# Altium schematic sheet Power Stages.SchDoc
size A2; SheetNumber: 1; SheetTotal: 3
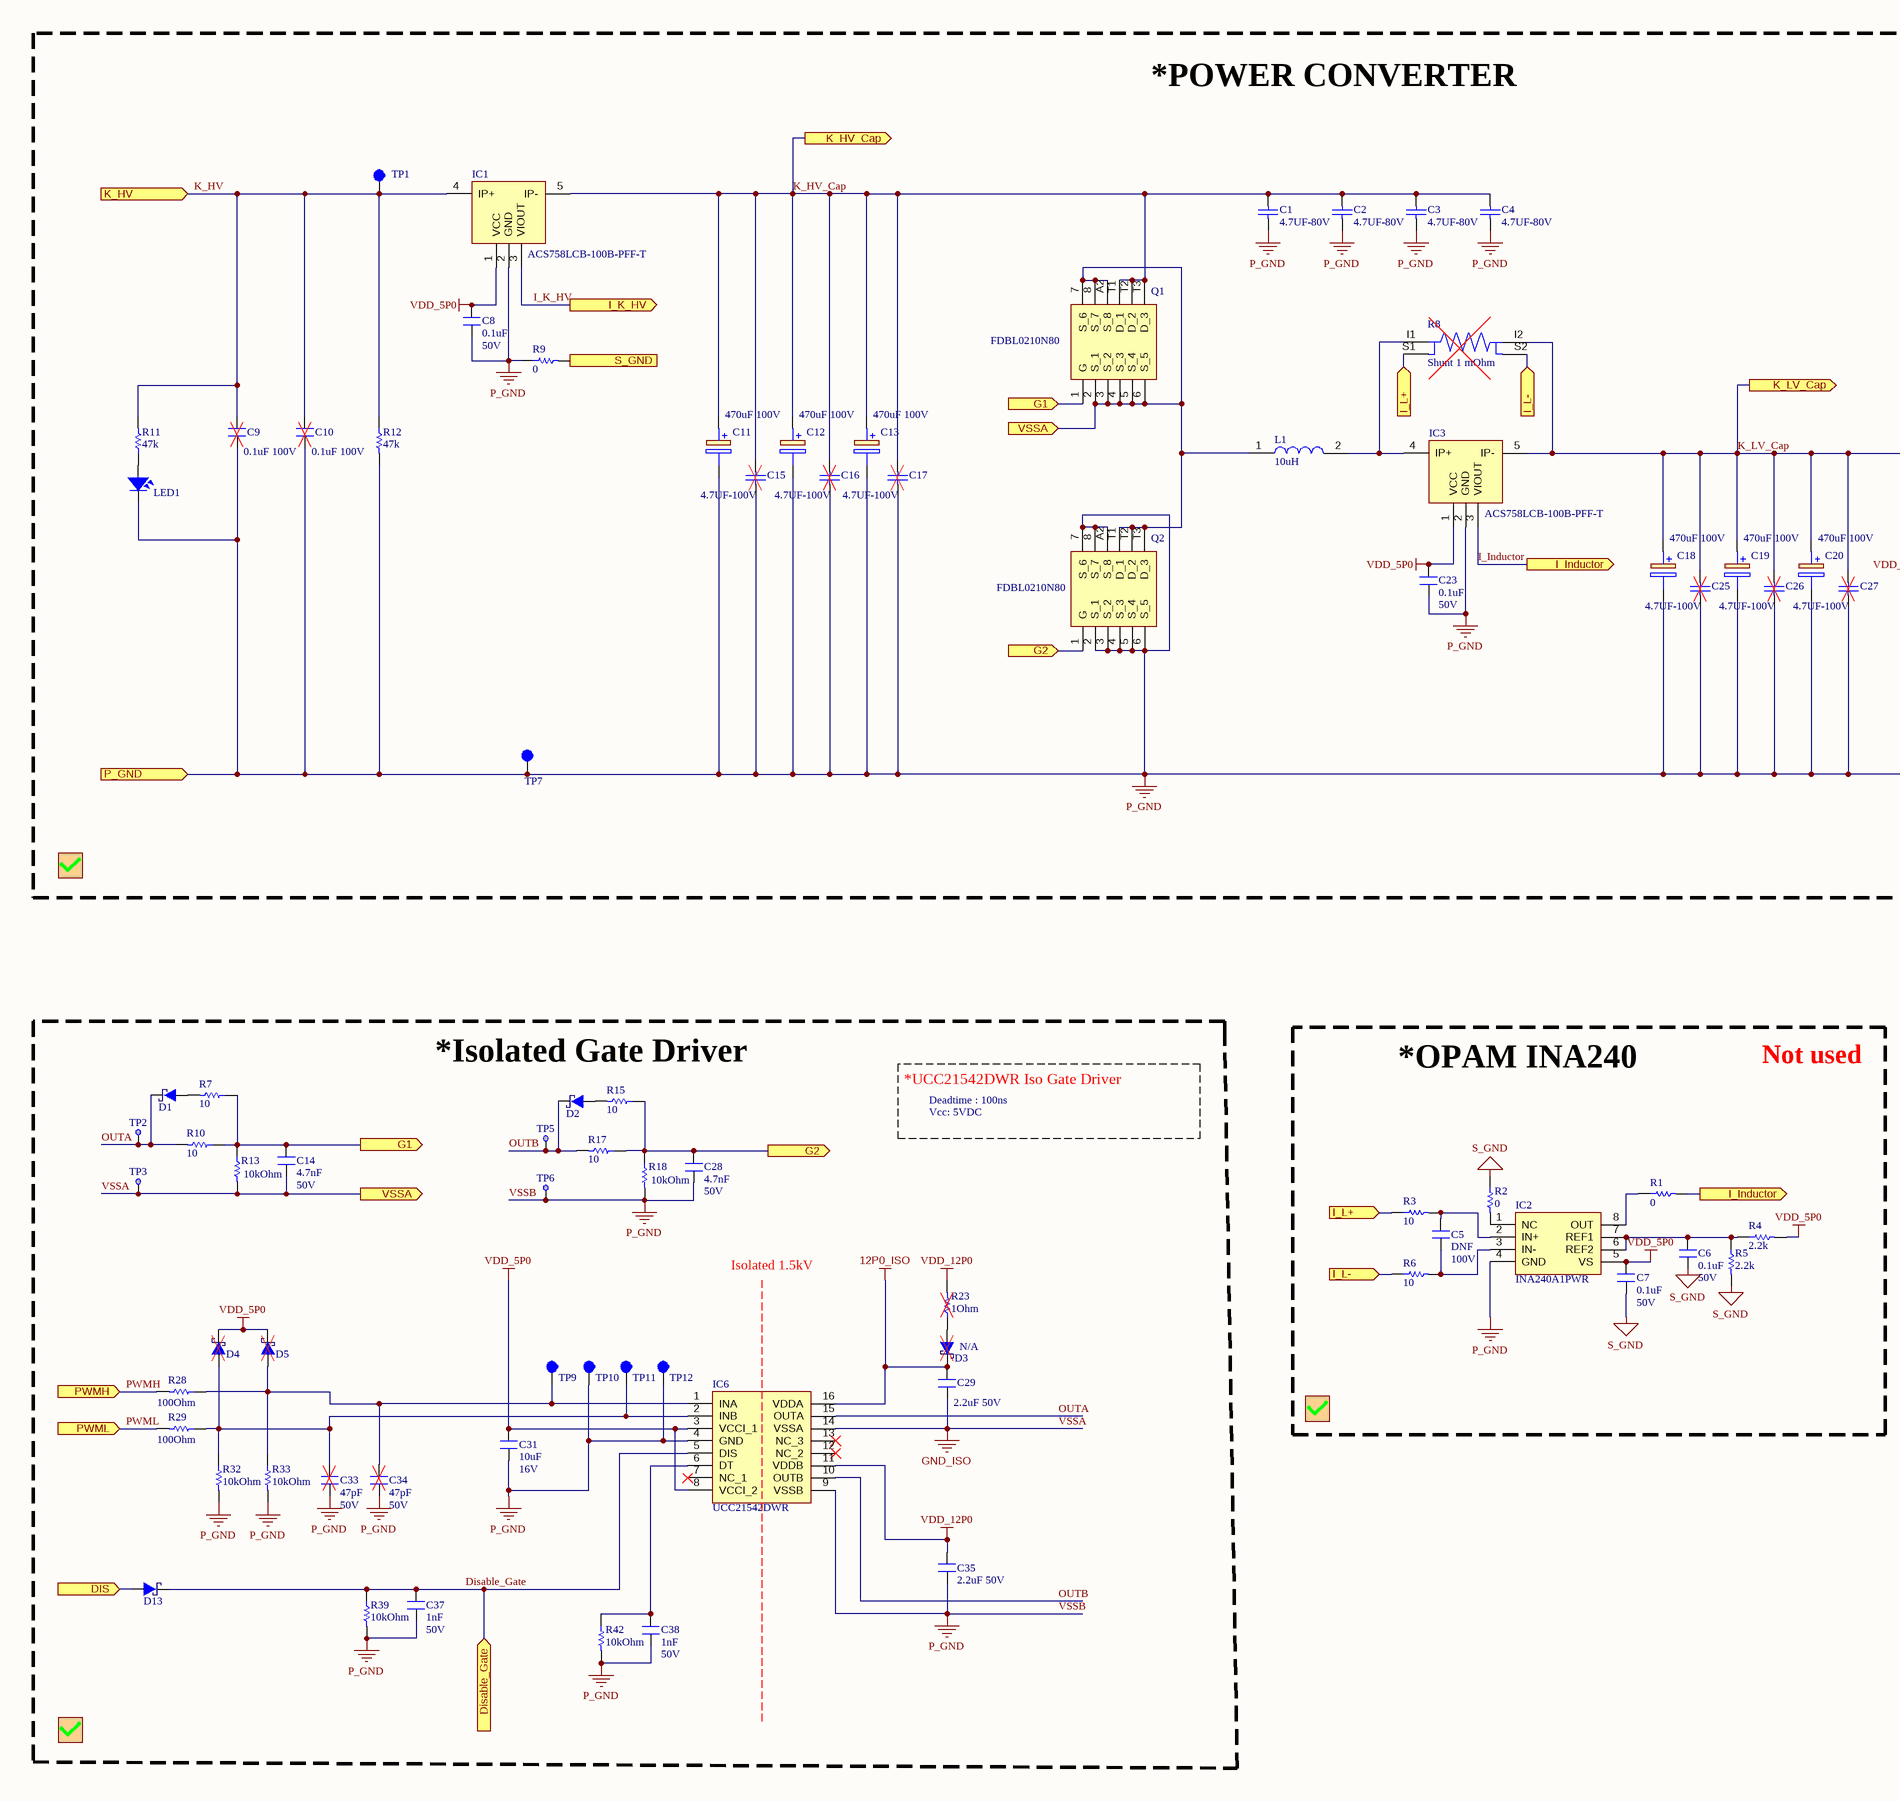
[diagram p0: Power Stages.SchDoc, left]
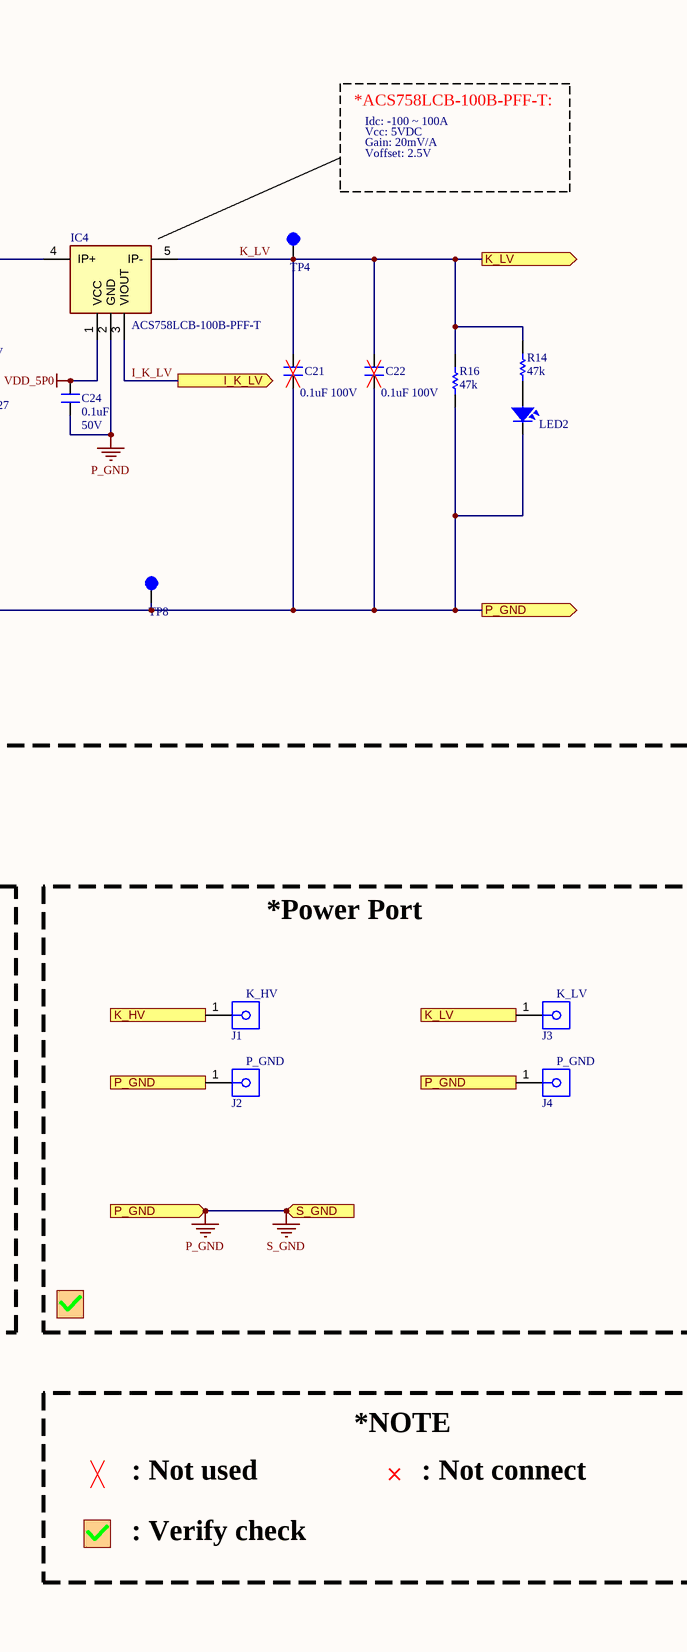
[diagram p1: Power Stages.SchDoc, right]

## Parts
C1  value 4.7UF-80V  [C_1210]  (hidden comment: GRM32ER71K475KE14L)
C2  value 4.7UF-80V  [C_1210]  (hidden comment: GRM32ER71K475KE14L)
C3  value 4.7UF-80V  [C_1210]  (hidden comment: GRM32ER71K475KE14L)
C4  value 4.7UF-80V  [C_1210]  (hidden comment: GRM32ER71K475KE14L)
C5  DNF  value 100V  [C_0603]
C6  0.1uF  value 50V  [C_0603]
C7  0.1uF  value 50V  [C_0603]
C8  0.1uF  value 50V  [C_0603]
C9  0.1uF 100V  [C_1206]
C10  0.1uF 100V  [C_1206]
C11  470uF 100V  [CAP-ALU-13MM*30MM]
C12  470uF 100V  [CAP-ALU-13MM*30MM]
C13  470uF 100V  [CAP-ALU-13MM*30MM]
C14  4.7nF  value 50V  [C_0603]
C15  value 4.7UF-100V  [C_1210]  (hidden comment: GRM32ER71K475KE14L)
C16  value 4.7UF-100V  [C_1210]  (hidden comment: GRM32ER71K475KE14L)
C17  value 4.7UF-100V  [C_1210]  (hidden comment: GRM32ER71K475KE14L)
C18  470uF 100V  [CAP-ALU-13MM*30MM]
C19  470uF 100V  [CAP-ALU-13MM*30MM]
C20  470uF 100V  [CAP-ALU-13MM*30MM]
C21  0.1uF 100V  [C_1206]
C22  0.1uF 100V  [C_1206]
C23  0.1uF  value 50V  [C_0603]
C24  0.1uF  value 50V  [C_0603]
C25  value 4.7UF-100V  [C_1210]  (hidden comment: GRM32ER71K475KE14L)
C26  value 4.7UF-100V  [C_1210]  (hidden comment: GRM32ER71K475KE14L)
C27  value 4.7UF-100V  [C_1210]  (hidden comment: GRM32ER71K475KE14L)
C28  4.7nF  value 50V  [C_0603]
C29  2.2uF 50V  [C_1206]
C31  10uF  value 16V  [C_0805]
C33  47pF  value 50V  [C_0603]
C34  47pF  value 50V  [C_0603]
C35  2.2uF 50V  [C_1206]
C37  1nF  value 50V  [C_0603]
C38  1nF  value 50V  [C_0603]
D1  B0520WS-7-F  [SOD323F]  (value not drawn)
D2  B0520WS-7-F  [SOD323F]  (value not drawn)
D3  PMEG2010AEJ,115  [SOD123]  (value not drawn)
D4  PMEG2010AEJ,115  [SOD323F]  (value not drawn)
D5  PMEG2010AEJ,115  [SOD323F]  (value not drawn)
D13  PMEG2010AEJ,115  [SOD323F]  (value not drawn)
IC1  ACS758LCB-100B-PFF-T  [ACS772ECB200BPFFT]
IC2  INA240A1PWR  [SOP65P640X120-8N]
IC3  ACS758LCB-100B-PFF-T  [ACS772ECB200BPFFT]
IC4  ACS758LCB-100B-PFF-T  [ACS772ECB200BPFFT]
IC6  UCC21542DWR  [SOIC127P1030X265-16N]
J1  K_HV  [HOLE_5mm_RED]
J2  P_GND  [HOLE_5mm_BLACK]
J3  K_LV  [HOLE_5mm_RED]
J4  P_GND  [HOLE_5mm_BLACK]
L1  10uH  [CSCF3218-6R8MC]
LED1  LED SMD  [SM-LED-0805-Blue]  (value not drawn)
LED2  LED SMD  [SM-LED-0805-Blue]  (value not drawn)
Q1  FDBL0210N80  [NTBLS1D5N10MC - duplicate]
Q2  FDBL0210N80  [NTBLS1D5N10MC - duplicate]
R1  0  [R_0603]
R2  0  [R_0603]
R3  10  [R_0603]
R4  2.2k  [R_0603]
R5  2.2k  [R_0603]
R6  10  [R_0603]
R7  10  [R_0805]
R8  Shunt 1 mOhm  [PSG4/PSF4]
R9  value 0  [R_0603]  (hidden comment: 0603)
R10  10  [R_0805]
R11  47k  [R_0603]
R12  47k  [R_1206]
R13  value 10kOhm  [R_0603]  (hidden comment: 0603)
R14  47k  [R_0603]
R15  10  [R_0805]
R16  47k  [R_1206]
R17  10  [R_0805]
R18  value 10kOhm  [R_0603]  (hidden comment: 0603)
R23  value 1Ohm  [R_0603]  (hidden comment: 0603)
R28  value 100Ohm  [R_0603]  (hidden comment: 0603)
R29  value 100Ohm  [R_0603]  (hidden comment: 0603)
R32  value 10kOhm  [R_0603]  (hidden comment: 0603)
R33  value 10kOhm  [R_0603]  (hidden comment: 0603)
R39  value 10kOhm  [R_0603]  (hidden comment: 0603)
R42  value 10kOhm  [R_0603]  (hidden comment: 0603)
TP1  Test Point  [TP_1mm_through_hole]  (value not drawn)
TP2  TP  [TP_1mm]  (value not drawn)  (no BOM)
TP3  TP  [TP_1mm]  (value not drawn)  (no BOM)
TP4  Test Point  [TP_1mm_through_hole]  (value not drawn)
TP5  TP  [TP_1mm]  (value not drawn)  (no BOM)
TP6  TP  [TP_1mm]  (value not drawn)  (no BOM)
TP7  Test Point  [TP_1mm_through_hole]  (value not drawn)
TP8  Test Point  [TP_1mm_through_hole]  (value not drawn)
TP9  Test Point  [TP_1mm_through_hole]  (value not drawn)
TP10  Test Point  [TP_1mm_through_hole]  (value not drawn)
TP11  Test Point  [TP_1mm_through_hole]  (value not drawn)
TP12  Test Point  [TP_1mm_through_hole]  (value not drawn)

## Blocks framed on the sheet
*POWER CONVERTER: C1-C4 C8-C13 C15-C27 IC1 IC3 IC4 L1 LED1 LED2 Q1 Q2 R8 R9 R11 R12 R14 R16 TP1 TP4 TP7 TP8
*Isolated Gate Driver: C14 C28 C29 C31 C33-C35 C37 C38 D1-D5 D13 IC6 R7 R10 R13 R15 R17 R18 R23 R28 R29 R32 R33 R39 R42 TP2 TP3 TP5 TP6 TP9-TP12
*OPAM INA240: C5-C7 IC2 R1-R6
*Power Port: J1-J4

## Ports
DIS (in), Disable_Gate (in), G1 (in), G1 (out), G2 (in), G2 (out), I_Inductor (out), I_K_HV (out), I_K_LV (out), I_L+ (in), I_L- (in), K_HV (in), K_HV_Cap (out), K_LV (in), K_LV (out), K_LV_Cap (out), P_GND (in), P_GND (out), PWMH (in), PWML (in), S_GND (in), S_GND (out), VSSA (in), VSSA (out)

## Nets
12P0_ISO: C29.2 D3.2 IC6.16(VDDA)
VDD_5P0: C7.1 C8.2 C23.2 C24.2 C31.2 D4.2 D5.2 IC1.1(VCC) IC2.5(VS) IC3.1(VCC) IC4.1(VCC) IC6.3(VCCI_1) IC6.8(VCCI_2) R4.1
VDD_12P0: C35.1 IC6.11(VDDB) R23.1
VSSA: C14.1 C29.1 IC6.14(VSSA) L1.1 Q1.2(S_1) Q1.3(S_2) Q1.4(S_3) Q1.5(S_4) Q1.6(S_5) Q1.7(S_6) Q1.8(S_7) Q1.A2(S_8) Q2.T1(D_1) Q2.T2(D_2) Q2.T3(D_3) R13.1 TP3.1(TP) ; port VSSA  [also labelled GND_ISO]
VSSB: C1.1 C2.1 C3.1 C4.1 C6.1 C7.2 C8.1 C9.1 C10.1 C11.2(-) C12.2(-) C13.2(-) C15.1 C16.1 C17.1 C18.2(-) C19.2(-) C20.2(-) C21.1 C22.1 C23.1 C24.1 C25.1 C26.1 C27.1 C28.1 C31.1 C33.2 C34.2 C35.2 C37.1 C38.1 IC1.2(GND) IC2.4(GND) IC3.2(GND) IC4.2(GND) IC6.4(GND) IC6.9(VSSB) J2.1 J4.1 LED1.2 LED2.2 Q2.2(S_1) Q2.3(S_2) Q2.4(S_3) Q2.5(S_4) Q2.6(S_5) Q2.7(S_6) Q2.8(S_7) Q2.A2(S_8) R2.2 R5.1 R9.1 R9.2 R12.1 R16.1 R18.1 R32.1 R33.1 R39.1 R42.1 TP6.1(TP) TP7.1(B) TP8.1(B) TP10.1(B) TP12.1(B) ; port P_GND, port S_GND  [also labelled P_GND, S_GND]
DIS: D13.1 ; port DIS
Disable_Gate: C37.2 D13.2 IC6.5(DIS) R39.2 ; port Disable_Gate
G1: C14.2 Q1.1(G) R7.2 R10.2 R13.2 ; port G1
G2: C28.2 Q2.1(G) R15.2 R17.2 R18.2 ; port G2
I_Inductor: IC3.3(VIOUT) R1.1 ; port I_Inductor
I_K_HV: IC1.3(VIOUT) ; port I_K_HV
I_K_LV: IC4.3(VIOUT) ; port I_K_LV
I_L+: R3.2 R8.S1 ; port I_L+
I_L-: R6.2 R8.S2 ; port I_L-
K_HV: C9.2 C10.2 IC1.4(IP+) J1.1 R11.1 R12.2 TP1.1(B) ; port K_HV
K_HV_Cap: C1.2 C2.2 C3.2 C4.2 C11.1(+) C12.1(+) C13.1(+) C15.2 C16.2 C17.2 IC1.5(IP-) Q1.T1(D_1) Q1.T2(D_2) Q1.T3(D_3) ; port K_HV_Cap
K_LV: C21.2 C22.2 IC4.5(IP-) J3.1 R14.1 R16.2 TP4.1(B) ; port K_LV
K_LV_Cap: C18.1(+) C19.1(+) C20.1(+) C25.2 C26.2 C27.2 IC3.5(IP-) IC4.4(IP+) R8.I2 ; port K_LV_Cap
OUTA: D1.2 IC6.15(OUTA) R10.1 TP2.1(TP)
OUTB: D2.2 IC6.10(OUTB) R17.1 TP5.1(TP)
PWMH: R28.1 ; port PWMH
PWML: R29.1 ; port PWML
NetC5_1: C5.1 IC2.2(IN+) R3.1
NetC5_2: C5.2 IC2.3(IN-) R6.1
NetC6_2: C6.2 IC2.6(REF2) IC2.7(REF1) R4.2 R5.2
NetC33_1: C33.1 D4.1 IC6.2(INB) R29.2 R32.2 TP11.1(B)
NetC34_1: C34.1 D5.1 IC6.1(INA) R28.2 R33.2 TP9.1(B)
NetC38_2: C38.2 IC6.6(DT) R42.2
NetD1_1: D1.1 R7.1
NetD2_1: D2.1 R15.1
NetD3_1: D3.1 R23.2
NetIC2_1: IC2.1(NC) R2.1
NetIC2_8: IC2.8(OUT) R1.2
NetIC3_4: IC3.4(IP+) L1.2 R8.I1
NetLED1_1: LED1.1 R11.2
NetLED2_1: LED2.1 R14.2

Not connected (* = marked no-connect by the designer): IC6 7(NC_1)* 12(NC_2)* 13(NC_3)*

## Notes on the sheet
- *ACS758LCB-100B-PFF-T:
- Idc: -100 ~ 100A
- Voffset: 2.5V
- Gain: 20mV/A
- Vcc: 5VDC
- *UCC21542DWR Iso Gate Driver
- Deadtime : 100ns
- Not used
- Isolated 1.5kV
- (near D3) N/A
- *NOTE
- : Not used
- : Not connect
- : Verify check
- Title:
- Project:
- Power Converter Module
- DC/DC Bidirectional Converter
- Revision:
- CLA Power Electronics
- 36 Xuan Thuy, Dich Vong Hau
- Draw:
- File Name:
- AnhDT
- Check:
- Approve:
- Sheet:
- 1
- Size:
- of
- A2
- Modified Date:
- Cau Giay - Ha Noi
- Time:
- Date:
- ©2023

## Library data of the parts
C1-C4 C15-C17 C25-C27 = Cap 1210: CAP CER 4.7uF 80V X7R 1210; Manufacturer: TDK Corporation; Description std: CAP CER 4.7UF 100V X7S 1210; Category: Capacitors; Part Number: GRM32ER71K475KE14L; Link: https://www.digikey.com/product-detail/en/tdk-corporation/C3225X7S2A475M200AB/445-6043-2-ND/2443521; Digikey Price/1KU: 0.56250; Package: 1210; Digikey Price/1unit: 1.64
C5 = Cap_Cer_0603_1nF: Manufacturer: Murata Electronics; Part Number: GCM188R71E102KA37D; Part Code: S1200-000081; Description SEL: CAP CER 1000PF 25V X7R 0603; Point: 2; Footprint Type: SMD
C6 C7 = Cap_Cer_0603_1nF: CAP CER 0.1UF 50V X7R 0603; Manufacturer: Murata Electronics; Part Number: GCM188R71E102KA37D; Part Code: S1200-000081; Description SEL: CAP CER 1000PF 25V X7R 0603; Point: 2; Footprint Type: SMD
C8 C23 C24 = Cap_Cer_0603_1nF_25V: CAP CER 0.1UF 16V X5R 0603; Manufacturer: Murata Electronics; Part Number: CL21A106KOCLRNC; Part Code: S1200-000082; Description SEL: CAP CER 10UF 16V X5R 0805; Point: 2; Footprint Type: SMD
C9 C10 C21 C22 C29 C35 = Cap_Cer_1206_1uF: Ceramic Capacitor 1206 (+-10% TH)/(+10%SMD); Manufacturer: TDK Corporation; Part Number: C3216X7R2A105K160AA; Part Code: S1200-000129; Description SEL: CAP CER 1UF 100V X7R 1206; Point: 2; Footprint Type: SMD
C11-C13 C18-C20 = 100ZLH470MEFC16X31.5: CAP ALUM 470UF 20% 80V RADIAL; Manufacturer_Name: Panasonic Electronic Components; Part Number: EEU-FS1K471L; Value: 470uF 80V; Height: 33.5mm; Mouser Part Number: EEU-FS1K471L; Mouser Price/Stock: https://www.digikey.com/en/products/detail/panasonic-electronic-components/EEU-FS1K471L/9597020; Arrow Part Number: EEU-FS1K471L; Arrow Price/Stock: https://www.arrow.com/en/products/100zlh470mefc16x31.5/rubycon?region=nac
C14 C28 = Cap_Cer_0603_1nF_25V: CAP CER 0805 4.7NF 50V C0G 5%; Manufacturer: KEMET; Part Number: C0805C472J5GECAUTO; Part Code: S1200-000082; Point: 2; Description SEL: CAP CER 0805 4.7NF 50V C0G 5%; Footprint Type: SMD
C31 = Cap_Cer_0805_10pF: CAP CER 10uF 16V X7R 0805; Manufacturer: Kemet; Part Number: CL21A106KOCLRNC; Part Code: S1200-000116; Point: 2; Description SEL: CAP CER 10uF 16V X7R 0805; Footprint Type: SMD
C33 C34 C37 C38 = Cap_Cer_0603_1nF_25V: CAP CER 1nF 50V X7R 0603; Manufacturer: Murata Electronics; Part Number: GCM188R71E102KA37D; Part Code: S1200-000082; Description SEL: CAP CER 1000PF 25V X7R 0603; Point: 2; Footprint Type: SMD
D1-D3 D13 = PMEG2010AEJ,115: DIODE SCHOTTKY 20V 1A SOD323F; Manufacturer: Nexperia USA Inc.; Current: 1A (DC); Category: DIODE; Part Number: PMEG2010AEJ,115; Footprint/Package: SOD-323F; Footprint type: SMD; Voltage: 20 V
D4 D5 = PMEG2010AEJ,115: DIODE SCHOTTKY 30V 0.2A SOD323F; Manufacturer: Nexperia USA Inc.; Part Number: BAT54HT1G; Current: 0.2A (DC); Voltage: 20 V; Category: DIODE; Footprint/Package: SOD-323F; Footprint type: SMD
IC1 IC3 IC4 = ACS758LCB-100B-PFF-T: Integrated Circuit; Manufacturer_Name: Allegro Microsystems; Datasheet Link: https://www.allegromicro.com/-/media/files/datasheets/acs758-datasheet.ashx; Height: 7.1mm; Manufacturer_Part_Number: ACS758LCB-100B-PFF-T; Mouser Part Number: 250-758LCB100BPFFT; Mouser Price/Stock: https://www.mouser.co.uk/ProductDetail/Allegro-MicroSystems/ACS758LCB-100B-PFF-T?qs=pUKx8fyJudA0WtlqV%2Fcrcw%3D%3D; Arrow Part Number: ACS758LCB-100B-PFF-T; Arrow Price/Stock: https://www.arrow.com/en/products/acs758lcb-100b-pff-t/allegro-microsystems?region=nac
IC2 = INA240A1PWR: Integrated Circuit; Manufacturer_Name: Texas Instruments; Datasheet Link: http://www.ti.com/lit/gpn/INA240; Height: 1.2mm; Manufacturer_Part_Number: INA240A1PWR; Mouser Part Number: 595-INA240A1PWR; Mouser Price/Stock: https://www.mouser.co.uk/ProductDetail/Texas-Instruments/INA240A1PWR?qs=aVyJF2WnouTDXnRi6tpqfA%3D%3D; Arrow Part Number: INA240A1PWR; Arrow Price/Stock: https://www.arrow.com/en/products/ina240a1pwr/texas-instruments?region=nac
IC6 = UCC21542DWR: REINFORCED ISOLATION DUAL-CHANNE; Manufacturer_Name: Texas Instruments; Datasheet Link: https://www.ti.com/lit/ds/symlink/ucc21542.pdf?ts=1623395410745&ref_url=https%253A%252F%252Fwww.ti.com%252Fstore%252Fti%252Fen%252Fp%252Fproduct%252F%253Fp%253DUCC21542DWKR; Height: 2.65mm; Part Number: UCC21542DWR; Mouser Part Number: 595-UCC21542DWR; Mouser Price/Stock: https://www.mouser.co.uk/ProductDetail/Texas-Instruments/UCC21542DWR?qs=DRkmTr78QARxjB5fL7Hhaw%3D%3D
J1-J4 = CONN_1P: Electric Pole 1; Footprint type: TH; Footprint/Package: Nonstandard
L1 = IHDF1300AEEH4R7K10: 10-µH with a specified saturation current of 70-A DC; Height: 15.4mm
LED1 LED2 = LED-SMD-0805: LED BLUE 1/4W 0805
Q1 Q2 = IPLU300N04S4R8XTMA1: MOSFET N-CH 80V 240A 8HPSOF; Manufacturer_Name: Infineon; Height: 2.3mm; Part Number: FDBL0210N80; Mouser Part Number: FDBL0210N80; Arrow Part Number: IPLU300N04S4R8XTMA1
R1 R2 = Resistor_0603_10Ohm 1%: RES 0 OHM 1% 1/8W 0603; Manufacturer: KOA Speer Electronics, Inc.; Part Number: RK73H1JRTTD10R0F; Part Code: S1100-000044; Description SEL: RES 10 OHM 1% 1/8W 0603; Point: 2; Value: 8.2-10kOhm; Footprint Type: SMD; Power: 1/8W; Tolerance: 1%
R3 R6 = Resistor_0603_10Ohm 1%: RES 10 OHM 1% 1/8W 0603; Manufacturer: KOA Speer Electronics, Inc.; Part Number: RK73H1JRTTD10R0F; Part Code: S1100-000044; Point: 2; Description SEL: RES 10 OHM 1% 1/8W 0603; Footprint Type: SMD; Power: 1/8W; Tolerance: 1%
R4 R5 = Resistor_0603_10Ohm 1%: RES 2.2k OHM 1% 1/8W 0603; Manufacturer: KOA Speer Electronics, Inc.; Part Number: RK73H1JRTTD10R0F; Part Code: S1100-000044; Description SEL: RES 10 OHM 1% 1/8W 0603; Point: 2; Footprint Type: SMD; Power: 1/8W; Tolerance: 1%
R7 R10 R15 R17 = Resistor_0805_10Ohm: RES 10 OHM 1% 1/8W 0805; Part Number: RE0805FRE0710RL; Manufacturer: YAGEO; Part Code: S1100-000072; Description SEL: RES SMD 10 OHM 1% 1/8W 0805; Point: 2; Footprint Type: SMD; Power: 1/8W; Tolerance: 1%
R8 = PSG4NTEBL500F: RES 1m OHM 1% 10W NONSTANDARD; Manufacturer: KOA Speer Electronics, Inc.; Value: 1 mOhm; Part Number: PSG4NTEBL500F; Footprint/Package: Nonstandard; Footprint type: SMD; Tolerance: ±1%; Category: Resistor
R9 = Resistor_0603_10kOhm 1%: RES 0 OHM 1% 1/10W 0603; Manufacturer: YAGEO; Part Number: RC0603FR-7W10KL; Part Code: S1100-000043; Description SEL: RES 10K OHM 1% 1/10W 0603; Point: 2; Footprint Type: SMD; Power: 1/10W; Tolerance: 1%
R11 R14 = Resistor_0603_10Ohm 1%: RES 47K OHM 1% 1/10W 0603; Manufacturer: YAGEO; Part Number: RC0603FR-07100KL; Part Code: S1100-000044; Description SEL: RES 10 OHM 1% 1/8W 0603; Point: 2; Power: 1/8W; Footprint Type: SMD; Tolerance: 1%
R12 R16 = Resistor_1206_0Ohm: RES 47K OHM 1/4W 1206; Manufacturer: YAGEO; Part Number: RC1206JR-070RL; Part Code: S1100-000177; Description SEL: RES 0 OHM JUMPER 1/4W 1206; Point: 2; Tolerance: Jumper; Footprint Type: SMD; Power: 1/4W
R13 R18 = Resistor_0603_10kOhm 1%: RES 10K OHM 1% 1/10W 0603; Manufacturer: YAGEO; Part Number: RC0603FR-7W10KL; Part Code: S1100-000043; Point: 2; Description SEL: RES 10K OHM 1% 1/10W 0603; Footprint Type: SMD; Power: 1/10W; Tolerance: 1%
R23 = Resistor_0603_1Ohm: RES 1OHM 1% 1/8W 0603; Manufacturer: Vishay Dale; Part Number: MCT06030C1008FP500; Part Code: S1100-000140; Point: 2; Description SEL: RES 1 OHM 1% 1/8W 0603; Footprint Type: SMD; Power: 1/8W; Tolerance: 1%
R28 R29 = Resistor_0603_100Ohm: RES 100 OHM 1% 1/8W 0603; Manufacturer: KOA Speer Electronics, Inc.; Part Number: RK73H1JRTTD1000F; Part Code: S1100-000052; Point: 2; Description SEL: RES 100 OHM 1% 1/8W 0603; Footprint Type: SMD; Power: 1/8W; Tolerance: 1%
R32 R33 R39 R42 = Resistor_0603_100Ohm: RES 10 kOHM 1% 1/8W 0603; Manufacturer: KOA Speer Electronics, Inc.; Part Number: RK73H1JRTTD1000F; Part Code: S1100-000052; Description SEL: RES 100 OHM 1% 1/8W 0603; Point: 2; Footprint Type: SMD; Power: 1/8W; Tolerance: 1%
TP1 TP4 TP7-TP12 = Test Point: PC TEST POINT COMPACT RED; Part Number: 5005; Manufacturer: Keystone Electronics
TP2 TP3 TP5 TP6 = Test_Point_1mm: Test Point; ComponentLink1Description: New link; ComponentLink1URL: *; ComponentLink2Description: New link; ComponentLink2URL: *; Creator: SELEX MOTORS JSC; Library Ref: Selex_Library